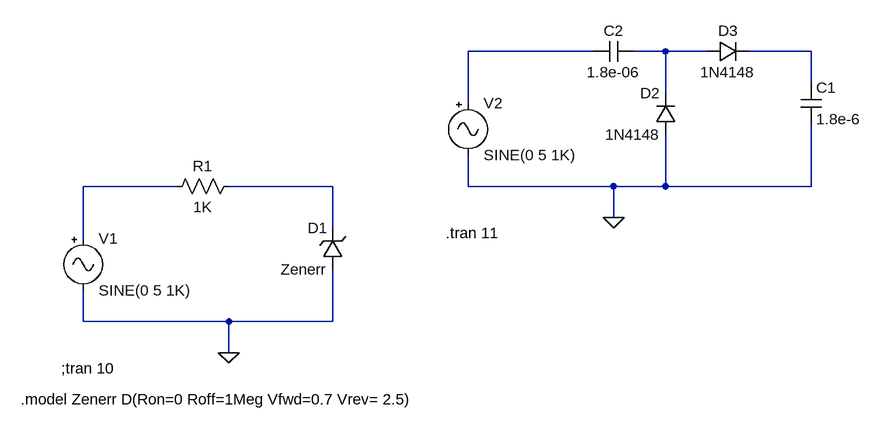
[diagram p0: schematic Draft1.asc]
Draft1.asc, the LTspice schematic file:
Version 4
SHEET 1 1656 680
WIRE 1088 -160 896 -160
WIRE 1200 -160 1152 -160
WIRE 1264 -160 1200 -160
WIRE 1424 -160 1328 -160
WIRE 1424 -112 1424 -160
WIRE 1200 -96 1200 -160
WIRE 896 -80 896 -160
WIRE 448 48 304 48
WIRE 688 48 528 48
WIRE 896 48 896 0
WIRE 1120 48 896 48
WIRE 1200 48 1200 -32
WIRE 1200 48 1120 48
WIRE 1424 48 1424 -48
WIRE 1424 48 1200 48
WIRE 1120 96 1120 48
WIRE 688 112 688 48
WIRE 304 128 304 48
WIRE 304 256 304 208
WIRE 528 256 304 256
WIRE 688 256 688 176
WIRE 688 256 528 256
WIRE 528 304 528 256
FLAG 528 304 0
FLAG 1120 96 0
SYMBOL Misc\\signal 304 112 R0
WINDOW 123 0 0 Left 0
WINDOW 39 0 0 Left 0
SYMATTR InstName V1
SYMATTR Value SINE(0 5 1K)
SYMBOL res 544 32 R90
WINDOW 0 0 56 VBottom 2
WINDOW 3 32 56 VTop 2
SYMATTR InstName R1
SYMATTR Value 1K
SYMBOL zener 704 176 R180
WINDOW 0 24 64 Left 2
WINDOW 3 24 0 Left 2
SYMATTR InstName D1
SYMATTR Value Zenerr
SYMBOL Misc\\signal 896 -96 R0
WINDOW 123 0 0 Left 0
WINDOW 39 0 0 Left 0
SYMATTR InstName V2
SYMATTR Value SINE(0 5 1K)
SYMBOL diode 1216 -32 R180
WINDOW 0 24 64 Left 2
WINDOW 3 24 0 Left 2
SYMATTR InstName D2
SYMATTR Value 1N4148
SYMBOL diode 1264 -144 R270
WINDOW 0 32 32 VTop 2
WINDOW 3 0 32 VBottom 2
SYMATTR InstName D3
SYMATTR Value 1N4148
SYMBOL cap 1408 -112 R0
SYMATTR InstName C1
SYMATTR Value 1.8e-6
SYMBOL cap 1152 -176 R90
WINDOW 0 0 32 VBottom 2
WINDOW 3 32 32 VTop 2
SYMATTR InstName C2
SYMATTR Value 1.8e-06
TEXT 208 376 Left 2 !.model Zenerr D(Ron=0 Roff=1Meg Vfwd=0.7 Vrev= 2.5)
TEXT 270 328 Left 2 !;tran 10
TEXT 862 120 Left 2 !.tran 11

The netlist it stands for:
* Draft1.asc
V1 N004 0 SINE(0 5 1K)
R1 N005 N004 1K
D1 0 N005 Zenerr
V2 N001 0 SINE(0 5 1K)
D2 0 N002 1N4148
D3 N002 N003 1N4148
C1 N003 0 1.8e-6
C2 N002 N001 1.8e-06
.model D D
.lib standard.dio
.model Zenerr D(Ron=0 Roff=1Meg Vfwd=0.7 Vrev= 2.5)
;tran 10
.tran 11
.backanno
.end